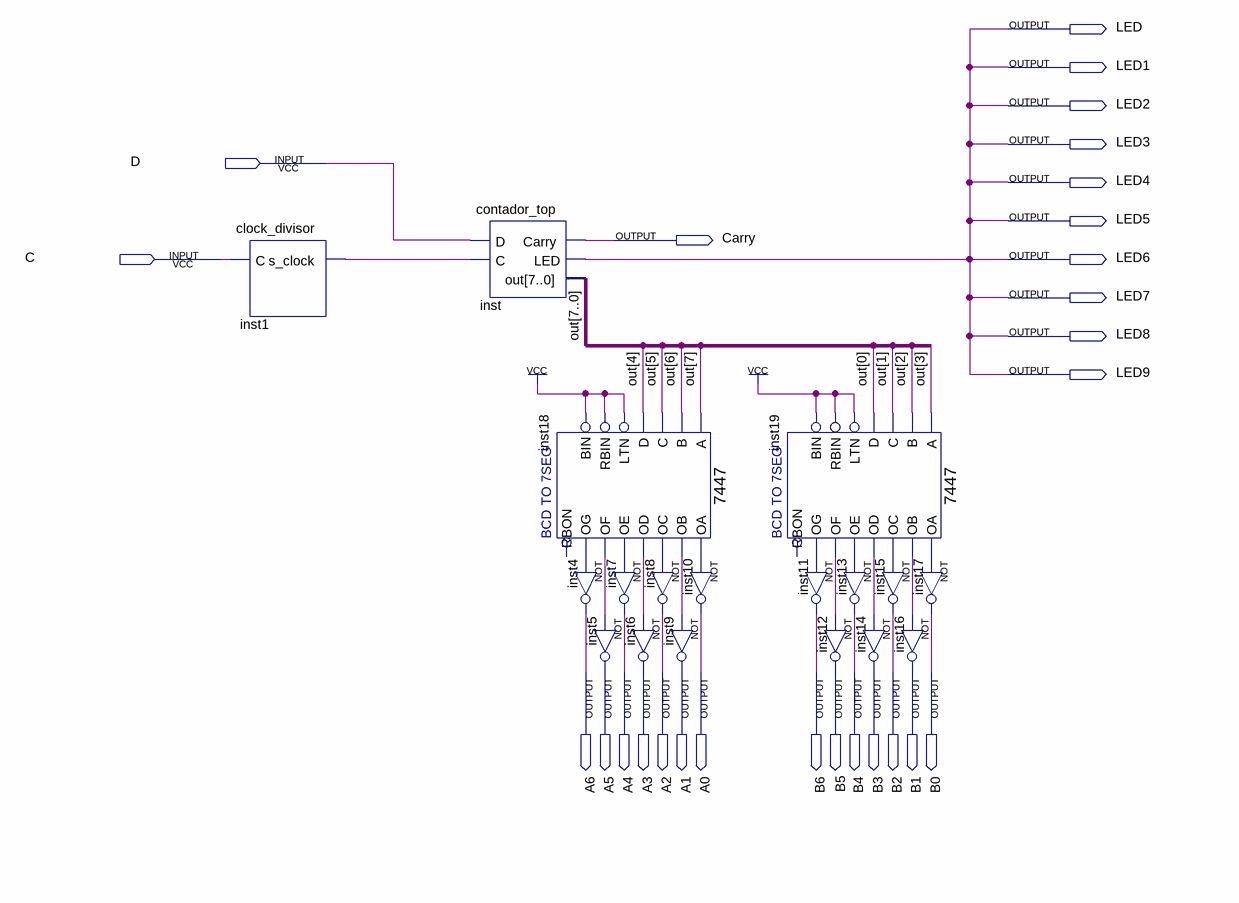
[diagram p0: schematic sheet]
// Quartus schematic trabalho_final.bdf as structural Verilog: 18 symbols, 27 pins
module trabalho_final (
  input  D,
  input  C,
  output LED,
  output LED1,
  output LED2,
  output LED3,
  output LED4,
  output LED5,
  output Carry,
  output LED6,
  output LED7,
  output LED8,
  output LED9,
  output A6,
  output A5,
  output A4,
  output A3,
  output A2,
  output A1,
  output A0,
  output B6,
  output B5,
  output B4,
  output B3,
  output B2,
  output B1,
  output B0
);

  wire inst1_s_clock, inst18_oa, inst18_ob, inst18_oc, inst18_od, inst18_oe, inst18_of, inst18_og, inst19_oa,
       inst19_ob, inst19_oc, inst19_od, inst19_oe, inst19_of, inst19_og;
  wire [7:0] out;

  clock_divisor inst1 (.C(C), .s_clock(inst1_s_clock));
  contador_top inst (.D(D), .C(inst1_s_clock), .Carry(Carry), .LED(LED), .out(out));
  \7447  inst18 (
    .LTN(1'b1), .B(out[6]), .C(out[5]), .D(out[4]), .RBIN(1'b1), .BIN(1'b1), .A(out[7]), .OB(inst18_ob),
    .OC(inst18_oc), .OE(inst18_oe), .OD(inst18_od), .OF(inst18_of), .OG(inst18_og), .OA(inst18_oa));  // open: RBON
  not inst4 (A6, inst18_og);
  not inst7 (A4, inst18_oe);
  not inst5 (A5, inst18_of);
  not inst6 (A3, inst18_od);
  not inst8 (A2, inst18_oc);
  not inst10 (A0, inst18_oa);
  not inst9 (A1, inst18_ob);
  \7447  inst19 (
    .LTN(1'b1), .B(out[2]), .C(out[1]), .D(out[0]), .RBIN(1'b1), .BIN(1'b1), .A(out[3]), .OB(inst19_ob),
    .OC(inst19_oc), .OE(inst19_oe), .OD(inst19_od), .OF(inst19_of), .OG(inst19_og), .OA(inst19_oa));  // open: RBON
  not inst11 (B6, inst19_og);
  not inst13 (B4, inst19_oe);
  not inst12 (B5, inst19_of);
  not inst14 (B3, inst19_od);
  not inst15 (B2, inst19_oc);
  not inst17 (B0, inst19_oa);
  not inst16 (B1, inst19_ob);

  assign LED1 = LED;
  assign LED2 = LED;
  assign LED3 = LED;
  assign LED4 = LED;
  assign LED5 = LED;
  assign LED6 = LED;
  assign LED7 = LED;
  assign LED8 = LED;
  assign LED9 = LED;
endmodule
